# EAGLE design circuitplay rev G (EAGLE 6.6.0)
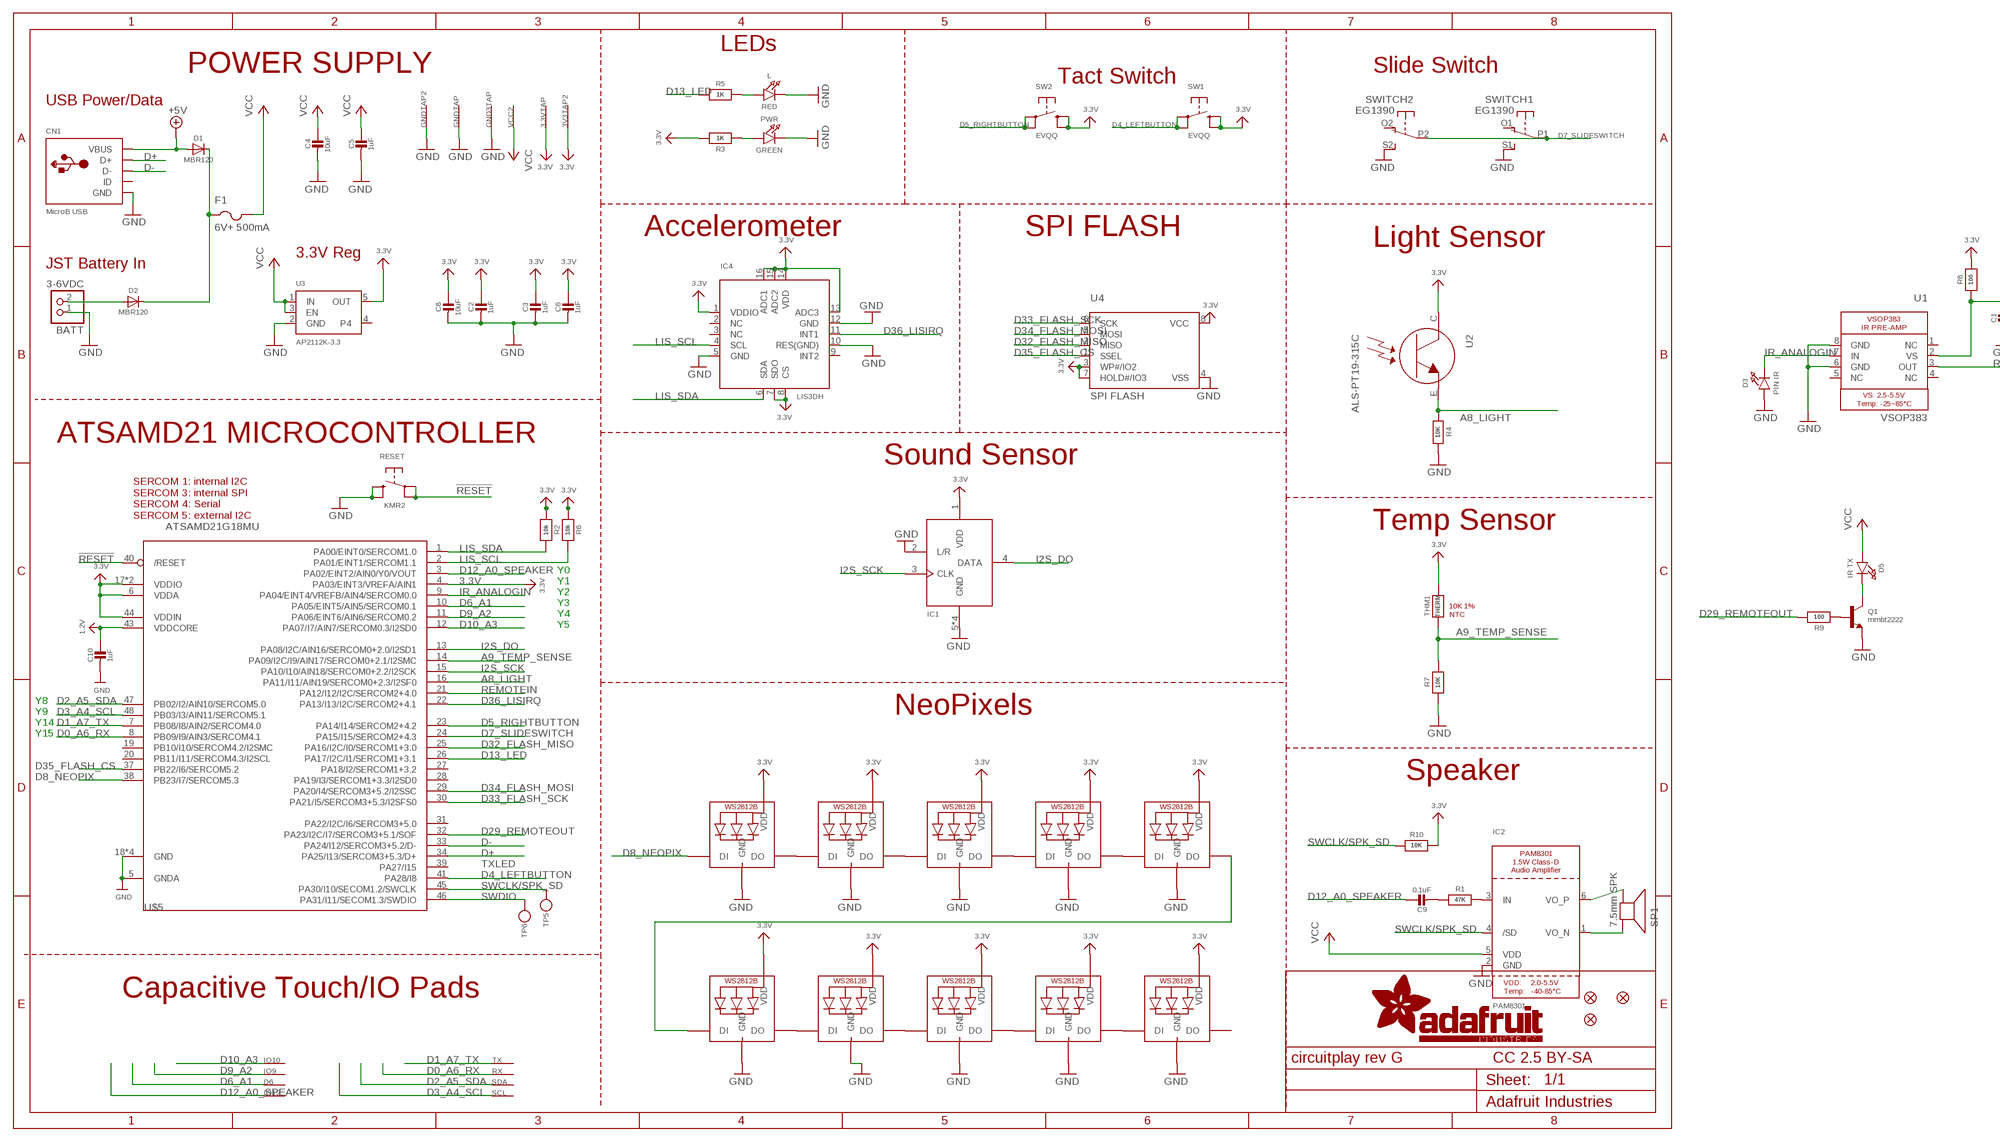
[diagram p0: schematic, sheet 1, part 1 of 2]
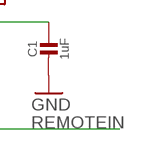
[diagram p1: schematic, sheet 1, part 2 of 2]

## Parts
3.3VTAP  SEWTAP-ALLIGATOR  [SEWALLI]
3V3TAP2  SEWTAP-ALLIGATOR  [SEWALLI]
BATT  3-6VDC  CON_JST_PH_2PIN  [JSTPH2]
C1  1uF  CAP_CERAMIC0603_NO  [0603-NO]
C2  1uF  CAP_CERAMIC0603_NO  [0603-NO]
C3  1uF  CAP_CERAMIC0603_NO  [0603-NO]
C4  10uF  CAP_CERAMIC0805-NOOUTLINE  [0805-NO]
C5  1uF  CAP_CERAMIC0603_NO  [0603-NO]
C6  1uF  CAP_CERAMIC0603_NO  [0603-NO]
C8  10uF  CAP_CERAMIC0805-NOOUTLINE  [0805-NO]
C9  0.1uF  CAP_CERAMIC0603_NO  [0603-NO]
C10  1uF  CAP_CERAMIC0603_NO  [0603-NO]
CN1  MicroB USB  USB_MICRO_20329_V2  [4UCONN_20329_V2]
D1  MBR120  DIODESOD-123  [SOD-123]
D2  MBR120  DIODESOD-123  [SOD-123]
D3  PIN IR  LED1206_NOOUTLINE  [CHIPLED_1206_NOOUTLINE]
D5  IR TX  LED1206_NOOUTLINE  [CHIPLED_1206_NOOUTLINE]
D6  SEWTAP-ALLIGATOR  [SEWALLI]
F1  6V+ 500mA  PTCFUSE-1206  [R1206]
GND3TAP  SEWTAP-ALLIGATOR  [SEWALLI]
GNDTAP  SEWTAP-ALLIGATOR  [SEWALLI]
GNDTAP2  SEWTAP-ALLIGATOR  [SEWALLI]
IC1  MIC_PDM  MIC_PDM_SPK0415  [SPK0415HM4H]
IC2  PAM8301  [SOT23-6]
IC4  LIS3DH  ACCEL_LIS3DHTR  [LGA16_3X3MM]
IO9  SEWTAP-ALLIGATOR  [SEWALLI]
IO10  SEWTAP-ALLIGATOR  [SEWALLI]
IO12  SEWTAP-ALLIGATOR  [SEWALLI]
L  RED  LED0805_NOOUTLINE  [CHIPLED_0805_NOOUTLINE]
LED1  WS2812B3535  [LED3535]
LED2  WS2812B3535  [LED3535]
LED3  WS2812B3535  [LED3535]
LED4  WS2812B3535  [LED3535]
LED5  WS2812B3535  [LED3535]
LED6  WS2812B3535  [LED3535]
LED7  WS2812B3535  [LED3535]
LED8  WS2812B3535  [LED3535]
LED9  WS2812B3535  [LED3535]
LED10  WS2812B3535  [LED3535]
PWR  GREEN  LED0805_NOOUTLINE  [CHIPLED_0805_NOOUTLINE]
Q1  mmbt2222  TRANSISTOR_NPN  [SOT23-R]
R1  47K  RESISTOR_0603_NOOUT  [0603-NO]
R2  10k  RESISTOR_0603_NOOUT  [0603-NO]
R3  1K  RESISTOR_0603_NOOUT  [0603-NO]
R4  10K  RESISTOR_0603_NOOUT  [0603-NO]
R5  1K  RESISTOR_0603_NOOUT  [0603-NO]
R6  10k  RESISTOR_0603_NOOUT  [0603-NO]
R7  10K  RESISTOR_0603_NOOUT  [0603-NO]
R8  100  RESISTOR_0603_NOOUT  [0603-NO]
R9  100  RESISTOR_0603_NOOUT  [0603-NO]
R10  10K  RESISTOR_0603_NOOUT  [0603-NO]
RESET  KMR2  SWITCH_TACT_SMT4.6X2.8  [BTN_KMR2_4.6X2.8]
RX  SEWTAP-ALLIGATOR  [SEWALLI]
SCL  SEWTAP-ALLIGATOR  [SEWALLI]
SDA  SEWTAP-ALLIGATOR  [SEWALLI]
SP1  7.5mm SPK  SPEAKER_7.5MM  [BUZZER_SMT_7.5MM]
SW1  EVQQ  SWITCH_TACT_SMT_EVQQ2_SMALL  [EVQ-Q2_SMALLER]
SW2  EVQQ  SWITCH_TACT_SMT_EVQQ2_SMALL  [EVQ-Q2_SMALLER]
SWITCH  EG1390  DPDT-EG1390  [EG1390]
THM1  THERM  RESISTOR_0402  [_0402]
TP5  TESTPOINTROUND1.5MM  [TESTPOINT_ROUND_1.5MM]
TP6  TESTPOINTROUND1.5MM  [TESTPOINT_ROUND_1.5MM]
TX  SEWTAP-ALLIGATOR  [SEWALLI]
U1  VSOP383  [VSOP383]
U2  ALS-PT19-315C  LIGHT_ALS-PT19-315C  [ALS-PT19-315C]
U3  AP2112K-3.3  VREG_SOT23-5  [SOT23-5]
U4  SPI FLASH  SPIFLASH_SOIC8  [SOIC8_150MIL]
U$2  FIDUCIAL_1MM  [FIDUCIAL_1MM]
U$3  FIDUCIAL_1MM  [FIDUCIAL_1MM]
U$5  ATSAMD21G18MU  ATSAMD21G_QFN  [TQFN48_7MM]
U$6  FIDUCIAL_1MM  [FIDUCIAL_1MM]
VCC2  SEWTAP-ALLIGATOR  [SEWALLI]

## Nets
1.2V: C10.1 U$5.43(VDDCORE)
3.3V: 3.3VTAP.P$1(SEW) 3V3TAP2.P$1(SEW) C2.1 C3.1 C6.1 C8.1 IC1.1(VDD) IC4.1(VDDIO) IC4.7(SDO) IC4.8(CS) IC4.13(ADC3) IC4.14(VDD) IC4.15(ADC2) IC4.16(ADC1) LED1.2(VDD) LED2.2(VDD) LED3.2(VDD) LED4.2(VDD) LED5.2(VDD) LED6.2(VDD) LED7.2(VDD) LED8.2(VDD) LED9.2(VDD) LED10.2(VDD) R2.1 R3.2 R6.1 R8.2 R10.2 SW1.B'(S1) SW1.B(S) SW2.B'(S1) SW2.B(S) THM1.2 U2.C U3.5(OUT) U4.3(WP#/IO2) U4.7(HOLD#/IO3) U4.8(VCC) U$5.4(PA03/EINT3/VREFA/AIN1) U$5.6(VDDA) U$5.17(VDDIO) U$5.36(VDDIO) U$5.44(VDDIN)
!RESET: RESET.A'(P1) RESET.A(P) U$5.40(/RESET)
+5V: CN1.VBUS D1.A
A8_LIGHT: R4.2 U2.E U$5.16(PA11/I11/AIN19/SERCOM0+2.3/I2SF0)
A9_TEMP_SENSE: R7.2 THM1.1 U$5.14(PA09/I2C/I9/AIN17/SERCOM0+2.1/I2SMC)
D0_A6_RX: RX.P$1(SEW) U$5.8(PB09/I9/AIN3/SERCOM4.1)
D1_A7_TX: TX.P$1(SEW) U$5.7(PB08/I8/AIN2/SERCOM4.0)
D2_A5_SDA: SDA.P$1(SEW) U$5.47(PB02/I2/AIN10/SERCOM5.0)
D3_A4_SCL: SCL.P$1(SEW) U$5.48(PB03/I3/AIN11/SERCOM5.1)
D4_LEFTBUTTON: SW1.A'(P1) SW1.A(P) U$5.41(PA28/I8)
D5_RIGHTBUTTON: SW2.A'(P1) SW2.A(P) U$5.23(PA14/I14/SERCOM2+4.2)
D6_A1: D6.P$1(SEW) U$5.10(PA05/EINT5/AIN5/SERCOM0.1)
D7_SLIDESWITCH: SWITCH.P1(1:P) SWITCH.P2(2:P) U$5.24(PA15/I15/SERCOM2+4.3)
D8_NEOPIX: LED6.1(DI) U$5.38(PB23/I7/SERCOM5.3)
D9_A2: IO9.P$1(SEW) U$5.11(PA06/EINT6/AIN6/SERCOM0.2)
D10_A3: IO10.P$1(SEW) U$5.12(PA07/I7/AIN7/SERCOM0.3/I2SD0)
D12_A0_SPEAKER: C9.1 IO12.P$1(SEW) U$5.3(PA02/EINT2/AIN0/Y0/VOUT)
D13_LED: R5.1 U$5.26(PA17/I2C/I1/SERCOM1+3.1)
D29_REMOTEOUT: R9.2 U$5.32(PA23/I2C/I7/SERCOM3+5.1/SOF)
D32_FLASH_MISO: U4.2(MISO) U$5.25(PA16/I2C/I0/SERCOM1+3.0)
D33_FLASH_SCK: U4.6(SCK) U$5.30(PA21/I5/SERCOM3+5.3/I2SFS0)
D34_FLASH_MOSI: U4.5(MOSI) U$5.29(PA20/I4/SERCOM3+5.2/I2SSC)
D35_FLASH_CS: U4.1(SSEL) U$5.37(PB22/I6/SERCOM5.2)
D36_LISIRQ: IC4.11(INT1) U$5.22(PA13/I13/I2C/SERCOM2+4.1)
D+: CN1.D+ U$5.34(PA25/I13/SERCOM3+5.3/D+)
D-: CN1.D- U$5.33(PA24/I12/SERCOM3+5.2/D-)
GND: BATT.1 C1.2 C2.2 C3.2 C4.2 C5.2 C6.2 C8.2 C10.2 CN1.BASE@1(GND) CN1.BASE@2(GND) CN1.GND CN1.SPRT@1(GND) CN1.SPRT@2(GND) CN1.SPRT@3(GND) CN1.SPRT@4(GND) D3.A GND3TAP.P$1(SEW) GNDTAP2.P$1(SEW) GNDTAP.P$1(SEW) IC1.2(L/R) IC1.5(GND) IC1.6(GND) IC1.7(GND) IC1.8(GND) IC2.2(GND) IC4.5(GND) IC4.10(RES(GND)) IC4.12(GND) L.C LED1.4(GND) LED2.4(GND) LED3.4(GND) LED4.4(GND) LED5.4(GND) LED6.4(GND) LED7.4(GND) LED8.4(GND) LED9.4(GND) LED10.4(GND) PWR.C Q1.2(E) R4.1 R7.1 RESET.B'(S1) RESET.B(S) SWITCH.S1(1:S) SWITCH.S2(2:S) U1.6(GND) U1.8(GND) U3.2(GND) U4.4(VSS) U$5.5(GNDA) U$5.18(GND) U$5.35(GND) U$5.42(GND) U$5.THERMAL(GND)
I2S_DO: IC1.4(DATA) U$5.13(PA08/I2C/AIN16/SERCOM0+2.0/I2SD1)
I2S_SCK: IC1.3(CLK) U$5.15(PA10/I10/AIN18/SERCOM0+2.2/I2SCK)
IR_ANALOGIN: D3.C U1.7(IN) U$5.9(PA04/EINT4/VREFB/AIN4/SERCOM0.0)
LIS_SCL: IC4.4(SCL) R6.2 U$5.2(PA01/EINT1/SERCOM1.1)
LIS_SDA: IC4.6(SDA) R2.2 U$5.1(PA00/EINT0/SERCOM1.0)
N$1: PWR.A R3.1
N$2: C1.1 R8.1 U1.2(VS)
N$3: D1.C D2.C F1.1
N$5: Q1.1(B) R9.1
N$6: C9.2 R1.1
N$7: BATT.2 D2.A
N$8: IC2.3(IN) R1.2
N$9: IC2.6(VO_P) SP1.-
N$10: L.A R5.2
N$11: LED1.1(DI) LED2.3(DO)
N$12: LED1.3(DO) LED3.1(DI)
N$13: LED2.1(DI) LED10.3(DO)
N$14: LED6.3(DO) LED7.1(DI)
N$15: IC2.1(VO_N) SP1.+
N$16: LED7.3(DO) LED8.1(DI)
N$17: LED8.3(DO) LED9.1(DI)
N$18: LED9.3(DO) LED10.1(DI)
N$19: LED3.3(DO) LED4.1(DI)
N$20: LED4.3(DO) LED5.1(DI)
N$21: D5.C Q1.3(C)
REMOTEIN: U1.3(OUT) U$5.21(PA12/I12/I2C/SERCOM2+4.0)
SWCLK/SPK_SD: IC2.4(/SD) R10.1 TP5.P$1 U$5.45(PA30/I10/SECOM1.2/SWCLK)
SWDIO: TP6.P$1 U$5.46(PA31/I11/SECOM1.3/SWDIO)
VCC: C4.1 C5.1 D5.A F1.2 IC2.5(VDD) U3.1(IN) U3.3(EN) VCC2.P$1(SEW)
Unconnected: CN1.ID IC4.2(NC) IC4.3(NC) IC4.9(INT2) LED5.3(DO) SWITCH.O1(1:O) SWITCH.O2(2:O) U1.1(NC) U1.4(NC) U1.5(NC) U3.4 U$5.19(PB10/I10/SERCOM4.2/I2SMC) U$5.20(PB11/I11/SERCOM4.3/I2SCL) U$5.27(PA18/I2/SERCOM1+3.2) U$5.28(PA19/I3/SERCOM1+3.3/I2SD0) U$5.31(PA22/I2C/I6/SERCOM3+5.0) U$5.39(PA27/I15)

## Notes on the sheet
- LEDs
- POWER SUPPLY | Slide Switch
- Tact Switch
- USB Power/Data
- Accelerometer | SPI FLASH
- Light Sensor
- 3.3V Reg
- JST Battery In
- ATSAMD21 MICROCONTROLLER
- Sound Sensor
- SERCOM 1: internal I2C
  SERCOM 3: internal SPI
  SERCOM 4: Serial
  SERCOM 5: external I2C
- Temp Sensor
- Y0
- Y1
- Y2
- Y3
- Y4
- 10K 1%
  NTC
- Y5
- Y8
- Y9 | NeoPixels
- Y14
- Y15
- Speaker
- TXLED
- Capacitive Touch/IO Pads
- CC 2.5 BY-SA

## Library data of the parts
3.3VTAP 3V3TAP2 D6 GND3TAP GNDTAP GNDTAP2 IO9 IO10 IO12 RX SCL SDA TX VCC2 = microbuilder:SEWTAP
BATT = microbuilder:CON_JST_PH_2PIN: JST 2-Pin Right-Angle Connector PH-Series - 4UConnector: 17311 SH-Series - 4UConnector: 07278
C1-C6 C8-C10 = microbuilder:CAP_CERAMIC: Ceramic Capacitors For new designs, use the packages preceded by an '_' character since they are more reliable: The following footprints should be used on most boards: _0402 - Standard footprint for regular board layouts _0603 - Standard footprint for regular board layouts _0805 - Standard footprint for regular board layouts _1206 - Standard footprint for regular board layouts For extremely tight-pitch boards where space is at a premium, the following 'micro-pitch' footprints can be used (smaller pads, no silkscreen outline, etc.): _0402MP - Micro-pitch footprint for very dense/compact boards _0603MP - Micro-pitch footprint for very dense/compact boards _0805MP - Micro-pitch footprint for very dense/compact boards _1206MP - Micro-pitch footprint for very dense/compact boards
CN1 = microbuilder:USB: USB Connectors USBMINIB - Surface Mount Female Mini-B USB Connector 4UConnector: 06564
D1 D2 = microbuilder:DIODE: Diode SMA Model Volts Amps Type Vf Ir Digikey # Notes SSA34-E3 40V 3A Schottky 480mV @ 3A 200uA @ 40V SSA34-E3/61TGITR-ND CDBA120-G 20V 1A Schottky 500mV @ 1A 500uA @ 20V 641-1014-6-ND REEL MBRA210 10V 2A Schottky 350mV @ 2A 700uA @ 10V MBRA210LT3 SOD-123 Model Volts Amps Type Vf Ir Order # Notes BAT54T1G 30V 200mA Schottky 800mV @ 200mA 2uA @ 25V BAT54T1GOSTR-ND B0530W 30V 500mA Schottky 430mV @ 500mA 130uA @ 30V B0530W-FDICT-ND REEL MBR120 20V 1A Schottky 340mV @ 1A MBR120VLSFT1GOSCT-ND SOD-323 Model Volts Amps Type Vf Ir Order # Notes PMEG2005EJ 20V 500mA Schottky 355mV @ 500mA 568-4110-1-ND ZLLS410 10V 570mA Schottky 380mV @ 570mA ZLLS410CT-ND 1N4148WS 75V 150mA Silicon/Simple 1V 1N4148WSFSCT-ND REEL SOD-523 Model Volts Amps Type Vf Ir Order # Notes BAT54XV2 30V 200mA Schottky 0.8V @ 100mA BAT54XV2CT-ND TB751S 30V 30mA Schottky RB751S-40TE61CT-ND SOT23-R/W (R = Solder Paste/Reflow Ovens, W = Hand-Soldering) Model Volts Amps Type Vf Ir Order # Notes BAT54FILM 40V 300mA Schottky 497-7162-1-ND POWERDI-5 Model Volts Amps Type Vf Ir Order # Notes PDS560 60V 5A Schottky 670mV @ 5A 150uA @ 60V PDS560DICT-ND
D3 D5 L PWR = microbuilder:LED: LED 0603 - 0603 Surface Mount Package 2mA: Green LED - Low Power (3.9mcd, 2ma, 1.7Vf) - Digikey: 475-2709-2-ND Orange LED - Low Power (9.8mcd, 2ma, 1.8Vf) - Digikey: 475-1194-2-ND Red LED - Low Power (5mcd, 2ma, 1.8Vf) - Digikey: 475-1195-2-ND Yellow LED - Low Power (7mcd, 2ma, 1.8Vf) - Digikey: 475-1196-2-ND 5mA: Blue LED - Low Power (17mcd, 5ma, 2.9Vf) - Digikey: LNJ937W8CRACT-ND 0805 - 0805 Surface Mount Package 2mA: Red LED (8.8mcd, 2mA, 1.8Vf, Clear) - Low Power [Digikey: 475-2510-1-ND] Green LED (5mcd, 2mA, 1.8Vf, Clear) - Low Power [Digikey: 475-2730-1-ND] Yellow LED (11.3mcd, 2mA, 1.8Vf, Clear) - Low Power [Digikey: 475-2555-1-ND] 20mA: Red LED (104mcd, 20mA, Diffused) - LS R976 [Digikey: 475-1278-6-ND] Red LED (12mcd, 20mA, 2.0Vf, Clear) - APT2012EC [Digikey: 754-1128-1-ND] Green LED (15mcd, 20mA, 2.2Vf, Clear) - APT2012GC [Digikey: 754-1131-1-ND] Orange LED (160mcd, 20mA, 2.1Vf, Clear) - APT2012SECK [Digikey: 754-1130-1-ND] 1206 - 1206 Surface Mount Package Green LED (26mcd, 20mA, Diffused) - LG N971 [Digikey: 475-1407-6-ND] Red LED (15mcd, 20mA, Diffused) - LH N974 [Digikey: 475-1416-6-ND] Cree - Cree High-Power Surface Mount LEDs XPEBWT-L1-0000-00D50 - White 111lm 350mA 2.9Vf 6200K 110° XTEAWT-00-0000-00000LEE3 - White 114lm 350mA 2.85Vf 5000K 115° Everlight - Everlight 45-21 Series Surface Mount LEDs 45-21/QK2C-B2832AC2CB2/2T - Warm White 2000mcd 20mA 3.25Vf 3050K 120° 45-21/LK2C-B38452C4CB2/2T - Nuetral White 2000mcd 20mA 3.25Vf 4150K 120° 45-21/LK2C-B50634C6CB2/2T - Cold White 2200mcd 20mA 3.25Vf 5650K 120° PLCC2 Reverse Mount LS T77K-J1L2-1-0-2-R18-Z - Red 11.25mcd 2mA 1.8Vf 630nm 120° LO T77K-L1M2-24-Z - Orange 19.6mcd 2mA 1.8Vf 606nm 120° LY T77K-K2M1-26-Z - Yellow 15.7mcd 2mA 1.8Vf 587nm 120°
F1 = adafruit:PTCFUSE: PTC fuses, resettable thermistors
IC1 = microbuilder:MIC_PDM
IC2 = microbuilder:PAM8301
IC4 = microbuilder:ACCEL_LIS3DHTR: LIS3DHTR 3-Axis Accelerometer with I2C/SPI Interface VDD: 1.71-3.6V VDDIO: 1.71-VDD+0.1V Scale: +/-2g, 4g, 8g, 16g with 16--bit data output Temp:: -40°C - 85°C Mouser: 511-LIS3DHTR Digikey: 497-10613-1-ND
LED1-LED10 = microbuilder:WS2812B
Q1 = microbuilder:TRANSISTOR_NPN: NPN Transistor Transistor (NPN) 500mA 45V - BC817 [Digikey: 568-1631-1-ND] Transistor (NPN) 500mA 45V - BC817,215 [Mouser: 771-BC817-T/R] SOT23-R - SOT23 footprint optimised for use with solder paste and reflow ovens. SOT23-W - SOT23 footprint optimised for hand-soldering (larger pads).
R1-R10 THM1 = microbuilder:RESISTOR: Resistors For new designs, use the packages preceded by an '_' character since they are more reliable: The following footprints should be used on most boards: _0402 - Standard footprint for regular board layouts _0603 - Standard footprint for regular board layouts _0805 - Standard footprint for regular board layouts _1206 - Standard footprint for regular board layouts For extremely tight-pitch boards where space is at a premium, the following 'micro-pitch' footprints can be used (smaller pads, no silkscreen outline, etc.): _0402MP - Micro-pitch footprint for very dense/compact boards _0603MP - Micro-pitch footprint for very dense/compact boards _0805MP - Micro-pitch footprint for very dense/compact boards _1206MP - Micro-pitch footprint for very dense/compact boards
RESET SW1 SW2 = microbuilder:SWITCH_TACT_SMT: SMT Tact Switches 6x6mm - Digikey: P12940SCT-ND KMR2 (4.6x2.8mm) - Digikey: 401-1426-1-ND EVQ-PQHB55 - Light Touch, 160GF (4.5x4.5mm) - Digikey: P8090SCT-ND KMT0 - KMT021 NGJ LHS (etc.) IP68/Waterproof - Digikey: CKN10289CT-ND
SP1 = microbuilder:SPEAKER: SPEAKER Source: Buerklin Added PS12 (for part # PS1240 piezo) http://www.ladyada.net/library/pcb/eaglelibrary.html
SWITCH = adafruit:DPDT
TP5 TP6 = microbuilder:TESTPOINT: Test Point Various test points for characterisation and PCB testing TESTPOINT_SMT - Compact Surface Mount Test Point [Digikey: 5016KTR-ND]
U1 = microbuilder:VSOP383: VSOP383 - Preamplifier Circuit for IR Remote Control
U2 = microbuilder:LIGHT_ALS-PT19-315C: ALS-PT19-315C - Analog Light Sensor VCC: 2.5-5.5V
U3 = microbuilder:VREG_SOT23-5: SOT23-5 Fixed Voltage Regulators Part Current Out V Out V In V Dropout θJA (°C/W) TJ (°C) Digikey Part No. ADP121 150mA 3.3V 3.4-5.5V 0.09V @ 150mA -- -- ADP121-AUJZ33R7CT-ND ADP121 150mA 3.0V 3.1-5.5V 0.09V @ 150mA -- -- ADP121-AUJZ30R7CT-ND ADP122 300mA 3.3V 3.4-5.5V 0.085V @ 300mA -- -- ADP122AUJZ-3.3-R7CT-ND ADP1712 300mA 3.3V 3.5-5.5V 0.17V @ 300mA -- -- ADP1712AUJZ-3.3-R7TR-ND AP7311 (Low Cost) 150mA 3.3V 3.5-6V 0.15V @ 150mA -- -- AP7311-33WG-7DICT-ND LD39015M18R 150mA 1.8V 1.9V-5.5V 0.08V @ 100mA -- -- 497-6977-1-ND LP2985A-33DBVR 150mA 3.3V 3.3-16V 0.28V @ 150mA 206 150 296-18479-1-ND MCP1824T-3302E/OT 300mA 3.3V 3.5V-6V 0.2V @ 300mA -- -- MCP1824T-3302E/OTCT-ND MIC5205-2.5YM5 TR 150mA 2.5V 2.7-16V 0.165V @ 150mA -- -- 576-1257-2-ND MIC5205-3.0YM5 TR 150mA 3.0V 3.2V-16V 0.165V @ 150mA -- -- 576-1258-2-ND MIC5205-3.3YM5 TR 150mA 3.3V 3.5V-16V 0.165V @ 150mA -- -- 576-1259-2-ND TPS780330220 150mA 3.3V+2.2V 3.6-5.5V 250mV Max -- -- 296-23332-1-ND TDA3663/N1,135 100mA 3.3V 3.5-45V 0.18V @ 50mA -- -- 568-5343-1-ND Max operating temp can be calculated using θJA, TJ (max junction temperature), and power in watts. Set the "Maximum Ambient Temperature" until it reaches TJ ("Max Junction Temperature"), which is the absolute limit for safe use of the regulator: Heat Sink Temperature Calculator <http://www.daycounter.com/Calculators/Heat-Sink-Temperature-Calculator.phtml> For example, With 12V source into a 3.3V LP2985 and a 30mA load, we are dissipating (12V-3.3V) * 0.03A = 0.261W. With a θJA of 206 °C/W, a TJ of 150°C, and 261mW we can safely use the chip without a heat sink up to 75°C (=147.1°C Junction Temperature).
U4 = microbuilder:SPIFLASH_SOIC8: SOIC8 SPI Flash Be careful with the size since SOIC8 flash comes in several 'widths' SOIC8 150 mil M25P16 - 16Mbit (2Mbit x 8) Serial Flash (75MHz SPI Bus), Supply: 2.7-3.6V Digikey: SOIC8 - M25P16-VMN6P-ND SOIC8 208 mil W25Q16BVSSIG - 16Mbit (2Mbit x 8) Serial Flash (104MHz SPI Bus), Supply: 2.7-3.6V Digikey: SOIC8 - W25Q16BVSSIG-ND
U$2 U$3 U$6 = microbuilder:FIDUCIAL: Fiducial Alignment Points Various fiducial points for machine vision alignment.; BOM: EXCLUDE
U$5 = microbuilder:ATSAMD21G

## Board
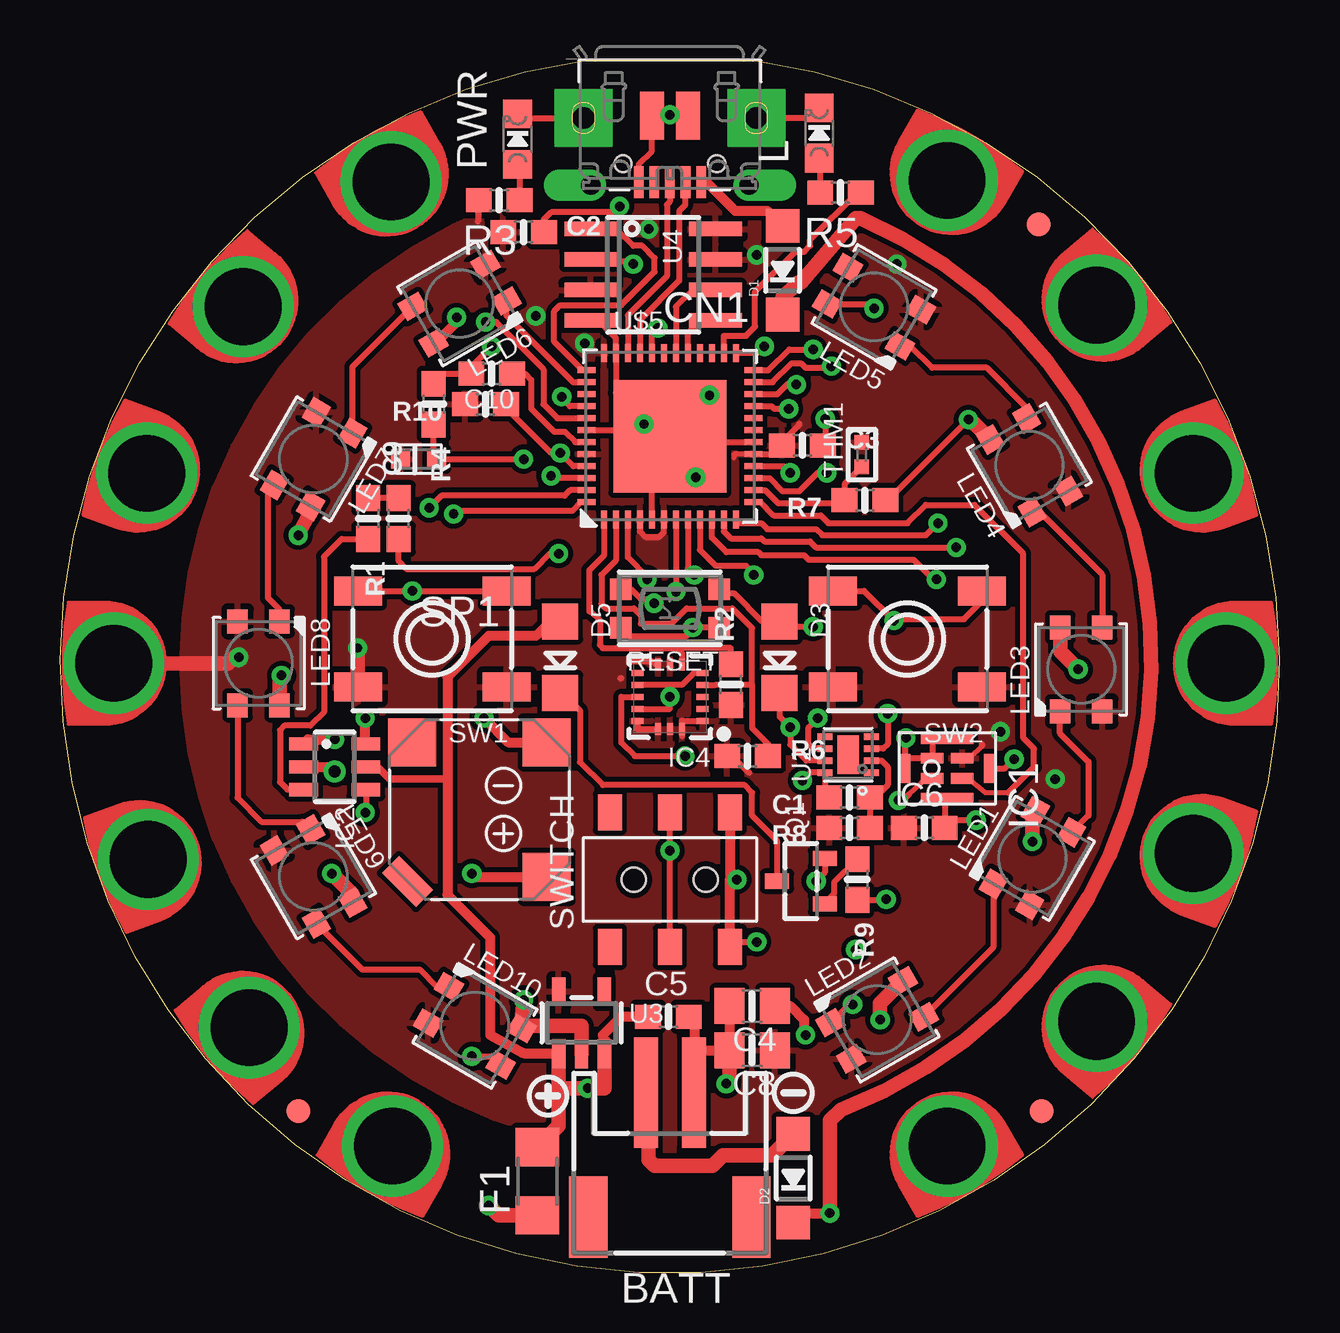
[diagram p2: board, top side]
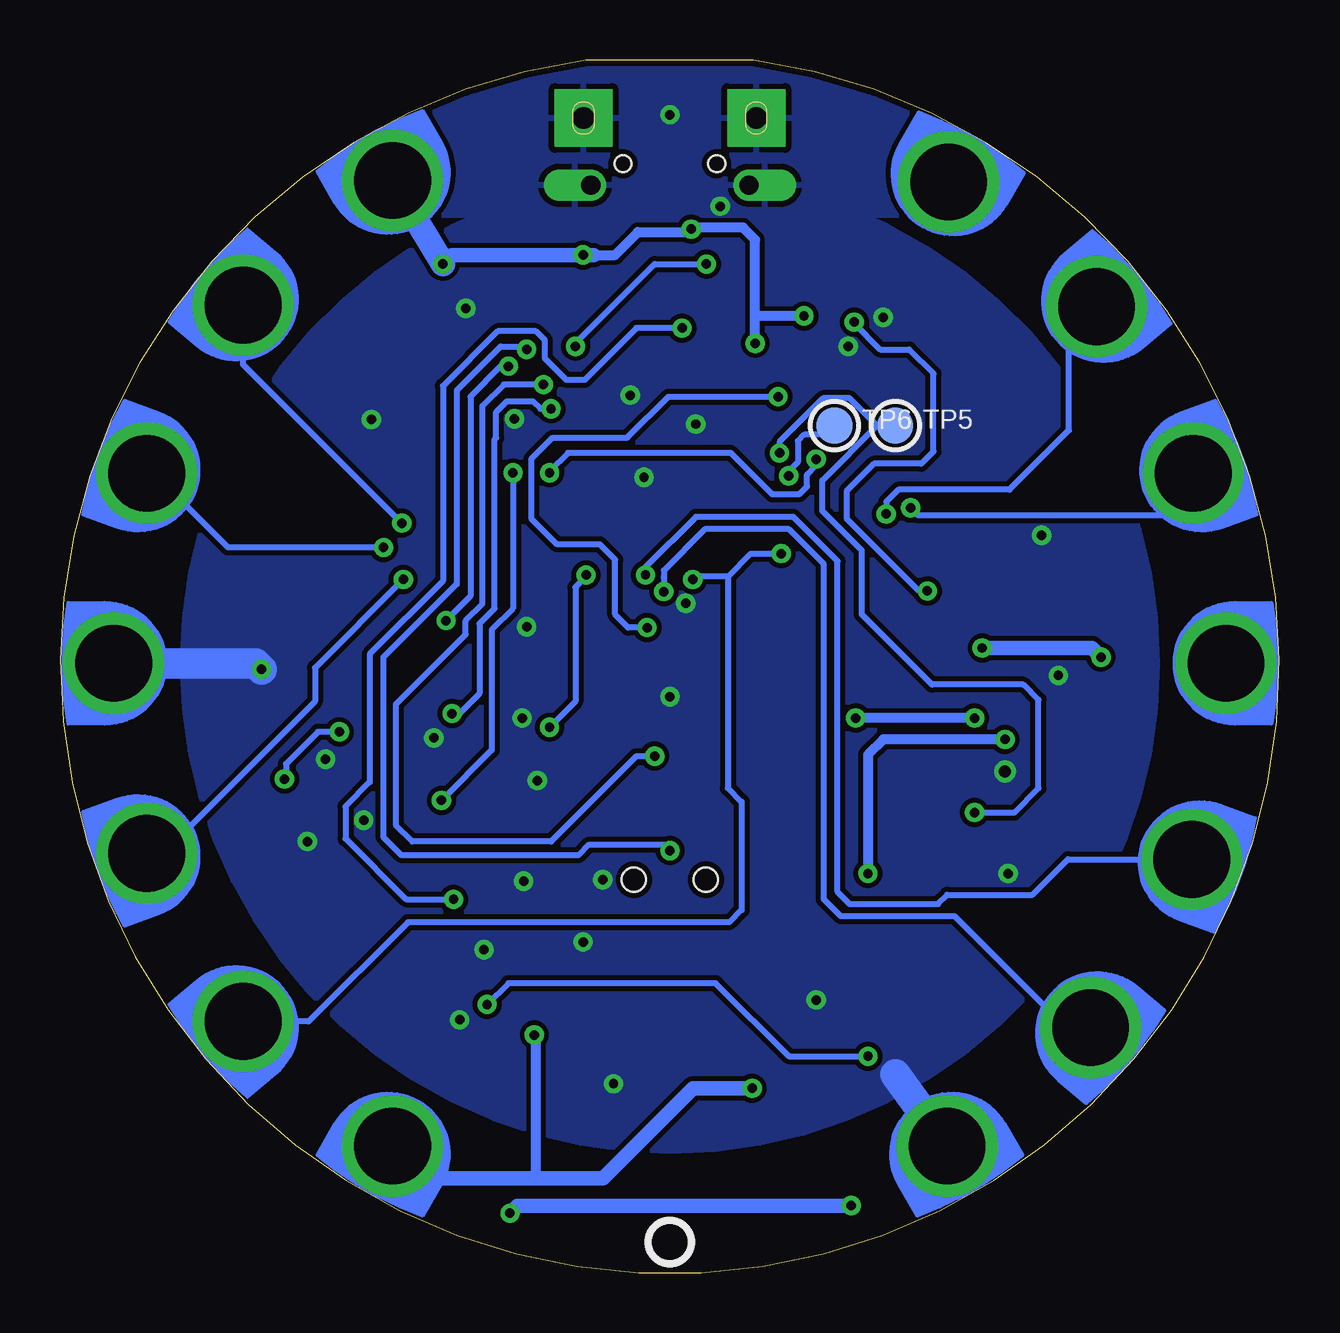
[diagram p3: board, bottom side, seen from below]

Size 50.82 x 50.55 mm. Coordinates in mm from the lower left corner, seen from the top.
Outline: 21.92,50.55 28.9,50.55 arc-344 21.92,50.55
Copper layers (1*16): Top 0.035mm / dielectric 1.5mm / Bottom 0.035mm
Design rules "adafruit *": minimum track width 8mil, minimum drill 15.5mil, track to track 8mil, track to pad 7mil, pad to pad 8mil, via to via 8mil, smd to smd 8mil, copper to edge 10mil, drill to drill 8mil, minimum pad ring 10mil, minimum via ring 8mil, stop-mask expansion 2mil, vias tented up to drill 20mil, thermal gap 10mil

### Footprints (pad centres in the part's own frame; a part is rotated, then mirrored left to right if it is on the bottom)
SEWALLI = drill 3.2: P$1 0,0.508
JSTPH2 = smd 1 x 4.6: 1 -1,-3.7; 2 1,-3.7 | smd 1.6 x 3.4: NC1 -3.4,1.5; NC2 3.4,1.5
0603-NO = smd 1.075 x 1: 1 -0.85,0; 2 0.85,0
0805-NO = smd 1.24 x 1.5: 1 -0.95,0; 2 0.95,0
4UCONN_20329_V2 = smd 1 x 2: BASE@1 -0.75,-2; BASE@2 0.75,-2 | smd 0.4 x 1.35: D+ 0,0.775; D- -0.65,0.775; GND 1.3,0.775; ID 0.65,0.775; VBUS -1.3,0.775 | drill 0.8 pad 1.143 offset: SPRT@1 -3.3,0.9; SPRT@2 3.3,0.9 | drill 0.9 pad 2.413 square: SPRT@3 -3.6,-1.9; SPRT@4 3.6,-1.9 | hole 0.7: -1.95,0; 1.95,0
SOD-123 = smd 1.4 x 1.4: A 1.85,0; C -1.85,0
CHIPLED_1206_NOOUTLINE = smd 1.5 x 1.5: A 0,-1.496; C 0,1.496
R1206 = smd 1.6 x 1.803: 1 -1.422,0; 2 1.422,0
SPK0415HM4H = smd 0.45 x 0.95: 1 0.425,-0.625; 2 0.425,0.625; 3 -0.425,0.625; 4 -0.425,-0.625 | smd 1.2 x 0.45: 5 0,-1.75; 7 0,1.75 | smd 0.45 x 2.2: 6 1.25,0; 8 -1.25,0
SOT23-6 = smd 0.55 x 1.2: 1 -0.95,-1.3; 2 0,-1.3; 3 0.95,-1.3; 4 0.95,1.3; 5 0,1.3; 6 -0.95,1.3
LGA16_3X3MM = smd 0.5 x 0.25: 1 -1.35,1; 2 -1.35,0.5; 3 -1.35,0; 4 -1.35,-0.5; 5 -1.35,-1; 9 1.35,-1; 10 1.35,-0.5; 11 1.35,0; 12 1.35,0.5; 13 1.35,1 | smd 0.25 x 0.5: 6 -0.5,-1.35; 7 0,-1.35; 8 0.5,-1.35; 14 0.5,1.35; 15 0,1.35; 16 -0.5,1.35
CHIPLED_0805_NOOUTLINE = smd 1.2 x 1.2: A 0,-1.05; C 0,1.05
LED3535 = smd 1 x 0.85: 1 -1.75,0.875; 2 -1.75,-0.875; 3 1.75,-0.875; 4 1.75,0.875
SOT23-R = smd 0.635 x 1.016: 1 -0.95,-1; 2 0.95,-1; 3 0,1
BTN_KMR2_4.6X2.8 = smd 0.9 x 0.9: A 2.05,0.8; A' -2.05,0.8; B 2.05,-0.8; B' -2.05,-0.8
BUZZER_SMT_7.5MM = smd 2 x 2: + 2.8,-2.8; - 2.8,2.8; MT2 -2.8,2.8 | smd 2 x 1 rotated 135: MT -3,-3
EVQ-Q2_SMALLER = smd 2 x 1.2: A -3.1,-2; A' 3.1,-2; B -3.1,2; B' 3.1,2
EG1390 = smd 1 x 1.5: O1 -2.5,2.8; O2 -2.5,-2.8; P1 0,2.8; P2 0,-2.8; S1 2.5,2.8; S2 2.5,-2.8 | hole 1: 1.5,0; -1.5,0
_0402 = smd 0.6 x 0.6: 1 -0.508,0; 2 0.508,0
TESTPOINT_ROUND_1.5MM = smd 1.5 x 1.5: P$1 0,0
VSOP383 = smd 0.275 x 0.625: 1 -0.75,-0.975; 2 -0.25,-0.975; 3 0.25,-0.975; 4 0.75,-0.975; 5 0.75,0.975; 6 0.25,0.975; 7 -0.25,0.975; 8 -0.75,0.975 | smd 1.6 x 0.9: THERMAL 0,0
ALS-PT19-315C = smd 0.8 x 0.8: C -0.75,0; E 0.75,0
SOT23-5 = smd 0.55 x 1.2: 1 -0.95,-1.3; 2 0,-1.3; 3 0.95,-1.3; 4 0.95,1.3; 5 -0.95,1.3
SOIC8_150MIL = smd 0.6 x 2.2: 1 -1.905,-2.6; 2 -0.635,-2.6; 3 0.635,-2.6; 4 1.905,-2.6; 5 1.905,2.6; 6 0.635,2.6; 7 -0.635,2.6; 8 -1.905,2.6
FIDUCIAL_1MM = smd 1 x 1: 1 0,0
TQFN48_7MM = smd 0.25 x 0.75: 1 -2.75,-3.475; 2 -2.25,-3.475; 3 -1.75,-3.475; 4 -1.25,-3.475; 5 -0.75,-3.475; 6 -0.25,-3.475; 7 0.25,-3.475; 8 0.75,-3.475; 9 1.25,-3.475; 10 1.75,-3.475; 11 2.25,-3.475; 12 2.75,-3.475; 25 2.75,3.475; 26 2.25,3.475; 27 1.75,3.475; 28 1.25,3.475; 29 0.75,3.475; 30 0.25,3.475; 31 -0.25,3.475; 32 -0.75,3.475; 33 -1.25,3.475; 34 -1.75,3.475; 35 -2.25,3.475; 36 -2.75,3.475 | smd 0.75 x 0.25: 13 3.475,-2.75; 14 3.475,-2.25; 15 3.475,-1.75; 16 3.475,-1.25; 17 3.475,-0.75; 18 3.475,-0.25; 19 3.475,0.25; 20 3.475,0.75; 21 3.475,1.25; 22 3.475,1.75; 23 3.475,2.25; 24 3.475,2.75; 37 -3.475,2.75; 38 -3.475,2.25; 39 -3.475,1.75; 40 -3.475,1.25; 41 -3.475,0.75; 42 -3.475,0.25; 43 -3.475,-0.25; 44 -3.475,-0.75; 45 -3.475,-1.25; 46 -3.475,-1.75; 47 -3.475,-2.25; 48 -3.475,-2.75 | smd 4.7 x 4.7: THERMAL 0,0

### Placement (x,y rotation side)
3.3VTAP  2.74,25.4 90 top
3V3TAP2  36.71,45.09 330 top
BATT  25.41,3.81 180 top
C1  32.9,19.81 180 top
C2  19.31,43.37 0 top
C3  30.93,34.48 0 top
C4  28.84,11.11 180 top
C5  25.35,10.67 0 top
C6  36.01,18.54 0 top
C8  28.84,9.27 180 top
C9  14.11,31.43 90 top
C10  17.98,37.47 180 top
CN1  25.41,46.23 180 top
D1  30.11,41.78 90 top
D2  30.55,3.94 90 top
D3  29.98,25.65 180 top
D5  20.84,25.65 180 top
D6  46.75,17.65 250 top
F1  19.89,3.81 90 top
GND3TAP  14.04,45.02 30 top
GNDTAP  48.08,25.4 270 top
GNDTAP2  14.11,5.72 150 top
IC1  36.97,21.02 90 top
IC2  11.44,21.08 270 top
IC4  25.41,24 180 top
IO9  46.75,33.15 290 top
IO10  42.81,40.01 310 top
IO12  42.81,10.8 230 top
L  31.63,47.5 0 top
LED1  40.52,17.27 60 top
LED2  34.05,10.54 30 top
LED3  42.55,25.15 90 top
LED4  40.4,33.66 120 top
LED5  33.92,40.26 150 top
LED6  16.65,40.39 210 top
LED7  10.55,33.91 240 top
LED8  8.26,25.4 270 top
LED9  10.55,16.51 300 top
LED10  17.28,10.29 330 top
PWR  19.06,47.24 0 top
Q1  30.87,16.32 90 top
R1  12.84,31.43 270 top
R2  27.95,24.51 90 top
R3  18.3,44.7 180 top
R4  15.57,36.2 270 top
R5  32.52,45.02 180 top
R6  28.65,21.53 0 top
R7  33.54,32.19 180 top
R8  32.9,18.54 180 top
R9  33.22,16.38 270 top
R10  17.73,36.2 180 top
RESET  25.41,27.69 180 top
RX  4.14,17.4 110 top
SCL  8.01,39.94 50 top
SDA  4.07,33.15 70 top
SP1  17.47,19.3 0 top
SW1  15.5,26.42 180 top
SW2  35.32,26.42 180 top
SWITCH  25.41,16.38 0 top
THM1  33.41,34.1 90 top
TP5  16.01,35.31 0 bottom
TP6  18.55,35.31 0 bottom
TX  8.26,10.54 130 top
U1  32.84,21.59 90 top
U2  14.93,33.91 0 top
U3  21.73,10.41 0 top
U4  24.71,41.59 270 top
U$1  [SYMBOL_MINUS]  30.55,7.49 0 top
U$2  40.78,43.69 0 top
U$3  9.92,6.73 0 top
U$4  [FLORAMED]  37.09,27.31 0 bottom
U$5  25.41,34.86 0 top
U$6  40.9,6.73 0 top
U$7  [PCBFEAT-REV-040]  25.41,1.27 0 bottom
U$16  [CPLAY_EXPRESS_FRONT_REVG]  0.01,0 0 top
U$35  [SYMBOL_PLUS]  20.33,7.37 0 top
U$46  [CPLAY_EXPRESS_BACK_REVD]  50.81,0 0 bottom
VCC2  36.71,5.72 210 top

### Tracks (layer width: path | path; a pad name or v marks a point on that pad's centre or on a via)
1.2V
  Top 0.254: U$5.43 21.47,34.61 21.03,35.05 20.58,35.05 19.63,36 19.63,37.21 19.37,37.47 C10.1
3.3V  (via drill 0.39)
  Top 0.203: U$5.17 28.08,34.11 28.08,33.97 | 37.9,21.44 38.43,21.97
  Top 0.254: R3.2 arc90 17.41,44.67 17.41,43.82 | U$5.4 24.16,30.91 24.39,30.67 24.96,30.67 25.16,30.86 U$5.6 | IC4.8 24.82,25.35 24.71,25.46 23.7,25.46 | 30.08,34.62 C3.1 30.08,34.11 U$5.17 | 30.08,34.62 30.08,34.77 | IC1.1 37.9,21.44 | 30.08,34.62 30.81,35.34 30.81,35.37 | 25.92,22.35 IC4.16 25.91,23 IC4.1 | 23.34,24.77 23.38,24.77 | IC4.13 24.06,22.65 IC4.14 | R6.1 28.01,21.53 28.71,20.83 | 38.43,21.97 38.43,22.04 | v41.48,20.57 41.48,20.45 41.54,20.38
  Top 0.61: 3.3VTAP.P$1 6.99,25.4 7.25,25.65 v7.44,25.65 | SW1.B' v12.39,26.04
  Bottom 0.254: v39.19,22.54 40.08,22.54 41.41,21.21 41.41,20.64 v41.48,20.57
  Bottom 0.406: v29.03,42.42 28.58,42.42 27.7,42.42 26.74,43.37 24.65,43.37 v24.52,43.5 24.46,43.56 22.36,43.56 21.85,43.05 21.85,39.88 | v21.85,38.74 21.85,39.88 | v19.82,39.88 21.85,39.88
  Bottom 0.61: 28.58,42.42 34.49,42.42 v34.87,42.04 | v12.39,26.04 7.82,26.04 v7.44,25.65
  Bottom 1.016: 3V3TAP2.P$1 v34.87,42.04
  pour Top: 25.41,5.08 arc-90 5.09,25.4 arc-90 25.41,45.72 arc-90 45.73,25.4 arc-90
!RESET  (via drill 0.39)
  Top 0.254: U$5.40 21.24,36.11 20.9,36.45 v20.9,36.51 | RESET.A 23.7,26.54 26.11,26.54 26.36,26.8 v26.36,26.89 RESET.A'
  Bottom 0.254: v20.9,36.51 25.47,36.51 27.19,34.8 30.3,34.8 31.19,33.91 31.19,31.43 30.11,30.35 28.33,30.35 27.7,29.72 27.7,27.43 27.15,26.89 v26.36,26.89
+5V
  Top 0.406: CN1.VBUS 26.94,45.45 28.13,44.26 29.47,44.26 D1.A
A8_LIGHT  (via drill 0.39)
  Top 0.254: U$5.16 30.15,33.61 v30.43,33.34 | 15.81,34.04 U2.E | 15.81,34.04 15.57,34.28 R4.2 | 15.81,34.04 15.94,33.91 v19.31,33.91
  Bottom 0.254: v30.43,33.34 30.43,33.4 29.66,34.16 22.87,34.16 21.15,32.45 20.01,32.45 19.69,32.77 19.69,33.27 19.31,33.66 v19.31,33.91
A9_TEMP_SENSE
  Top 0.254: U$5.14 29.37,32.61 29.92,32.07 32.56,32.07 R7.2 | 32.5,32 R7.2 | THM1.1 32.69,32.87 R7.2
D0_A6_RX  (via drill 0.39)
  Top 0.254: U$5.8 26.16,29.35 v26.43,29.08
  Bottom 0.254: 3.06,17.27 3.1,17.23 RX.P$1 8.82,17.23 10.3,15.75 13.85,15.75 14.23,15.37 17.92,15.37 18.42,15.88 18.42,29.66 20.27,31.5 24.33,31.5 26.43,29.4 v26.43,29.08 26.43,29.27
D1_A7_TX  (via drill 0.39)
  Top 0.254: U$5.7 v25.66,28.39
  Bottom 0.254: 9.14,10.21 8.9,10.21 | 8.9,10.21 TX.P$1 | v25.66,28.39 25.66,28.96 25.66,29.02 25.66,29.27 23.95,30.99 20.46,30.99 19,29.53 19,15.56 18.3,14.86 13.54,14.86 8.9,10.21
D2_A5_SDA  (via drill 0.39)
  Top 0.254: U$5.47 21.25,32.61 21.03,32.39 15.88,32.39 v15.38,31.88
  Bottom 0.254: v15.38,31.88 15.06,31.56 4.85,31.56 3.6,32.81 SDA.P$1
D3_A4_SCL  (via drill 0.39)
  Top 0.254: U$5.48 21.71,32.11 21.35,31.75 16.52,31.75 v16.39,31.62
  Bottom 0.254: 8.71,39.18 SCL.P$1 8.77,39.12 8.77,35.12 11.25,32.64 15.88,32.64 16.39,32.13 v16.39,31.62
D4_LEFTBUTTON  (via drill 0.39)
  Top 0.254: SW1.A v14.68,28.42 SW1.A' | U$5.41 20.72,35.61 20.14,36.2 20.14,37.66 18.17,39.62 v17.73,39.62
  Bottom 0.254: v17.73,39.62 17.73,39.56 16.65,38.48 15.44,38.48 14.42,37.47 14.42,34.23 14.93,33.72 16.9,33.72 18.04,32.58 18.04,31.43 15.03,28.42 v14.68,28.42
D5_RIGHTBUTTON  (via drill 0.39)
  Top 0.254: U$5.23 29.69,37.11 30.49,37.91 30.87,37.91 31.06,37.72 32.08,37.72 v32.14,37.78 | SW2.A 38.42,27.99 37.66,27.24 34.81,27.24 v34.74,27.18 33.51,28.42 SW2.A'
  Bottom 0.254: v34.74,27.18 33.73,28.19 33.73,36.51 32.46,37.78 v32.14,37.78
D6_A1  (via drill 0.39)
  Top 0.254: U$5.10 27.16,30.64 27.76,30.04 29.09,30.04 29.22,29.91 31,29.91 31.19,29.72 35.57,29.72 36.4,28.89 v36.52,28.89
  Bottom 0.254: 47.05,17.65 D6.P$1 46.54,17.48 40.21,23.81 40.21,25.21 v36.52,28.89
D7_SLIDESWITCH  (via drill 0.39)
  Top 0.254: U$5.24 29.52,37.61 30.39,38.48 v31.38,38.48 | SWITCH.P1 v25.41,17.59 SWITCH.P2
  Bottom 0.254: v25.41,17.59 25.66,17.84 28.77,17.84 29.22,17.4 36.59,17.4 37.35,18.16 37.35,25.65 34.3,28.7 34.3,36.77 32.46,38.61 31.51,38.61 v31.38,38.48
D8_NEOPIX
  Top 0.254: U$5.38 21.38,37.11 18.6,39.89 LED6.1
D9_A2  (via drill 0.39)
  Top 0.254: 45.98,33.78 46.83,32.93 IO9.P$1 46.89,33.66 | U$5.11 27.66,30.9 27.95,30.61 29.22,30.61 29.35,30.48 31.25,30.48 31.51,30.23 v37.35,30.23
  Bottom 0.254: 46.03,33.32 IO9.P$1 46.99,33.08 46.68,33.08 43.82,30.23 v37.35,30.23
D10_A3  (via drill 0.39)
  Top 0.254: U$5.12 28.3,31.24 29.22,31.24 29.47,30.99 31.51,30.99 31.76,30.73 36.08,30.73 v36.59,31.24
  Bottom 0.254: v36.59,31.24 43.2,37.85 IO10.P$1
D12_A0_SPEAKER  (via drill 0.39)
  Top 0.254: U$5.3 23.66,29.82 24.46,29.02 v24.46,28.89 | C9.1 14.11,29.66 14.42,29.34 19.76,29.34 20.39,29.97 v20.77,29.97
  Bottom 0.254: 24.46,28.96 v24.46,28.89 24.33,29.02 23,29.02 | 23,29.02 23,20.19 22.42,19.62 22.42,15.11 22.93,14.61 36.33,14.61 40.47,10.47 IO12.P$1 | 23,29.02 22.04,29.97 v20.77,29.97
D13_LED
  Top 0.254: U$5.26 27.66,39.05 28.58,39.05 28.97,39.43 28.97,40.89 30.62,42.55 31,42.55 31.25,42.8 31.25,43.05 33.22,45.02 R5.1
D29_REMOTEOUT  (via drill 0.39)
  Top 0.254: U$5.32 24.66,39.13 v24.9,39.37 | R9.2 34.4,15.53 v34.43,15.56
  Bottom 0.254: v24.9,39.37 26.81,39.37 28.97,37.21 29.73,37.21 30.62,38.1 30.62,38.86 31,39.24 32.59,39.24 34.87,36.96 34.87,28.83 37.92,25.78 37.92,20.45 38.93,19.43 38.93,18.1 36.4,15.56 v34.43,15.56
D32_FLASH_MISO  (via drill 0.39)
  Top 0.254: U$5.25 28.18,38.35 29.09,38.35 v29.35,38.61 | U4.2 22.17,42.16 23.76,42.16 v23.89,42.04
  Bottom 0.254: v23.89,42.04 26.04,42.04 29.41,38.67 v29.35,38.61
D33_FLASH_SCK
  Top 0.254: U4.6 26.36,40.96 25.66,40.26 U$5.30
D34_FLASH_MOSI
  Top 0.254: U$5.29 26.16,39.17 26.68,39.69 U4.5
D35_FLASH_CS
  Top 0.254: U$5.37 21.77,37.61 20.58,38.8 20.58,40.07 20.84,40.32 23.38,40.32 24.77,41.72 24.77,42.29 24.27,42.8 23.89,42.8 23.19,43.5 U4.1
D36_LISIRQ  (via drill 0.39)
  Top 0.254: U$5.22 29.89,36.61 30.3,37.02 v30.68,37.02 | v26.04,21.53 23.95,21.53 23.38,22.1 23.38,24 IC4.11
  Bottom 0.254: v30.68,37.02 30.68,36.96 30.74,37.02 32.33,37.02 33.22,36.13 33.22,27.88 33.92,27.18 33.92,26.61 36.84,23.69 36.84,18.67 36.14,17.97 30.36,17.97 26.81,21.53 v26.04,21.53
D+
  Top 0.254: U$5.34 23.66,39.91 25.28,41.53 25.28,44.51 25.41,44.64 CN1.D+
D-
  Top 0.254: CN1.D- 26.06,44.51 25.79,44.25 25.79,41.34 24.16,39.71 U$5.33
GND  (via drill 0.39, 0.5)
  Top 0.254: PWR.C arc90 19.23,48.13 CN1.SPRT@4 | L.C 31.21,48.13 CN1.SPRT@3 | 10.42,31.95 LED7.4 10.43,31.74 | 13.73,5.84 13.73,5.4 | CN1.GND 24.11,46.2 24.66,46.75 CN1.BASE@2 CN1.BASE@1 26.13,48.26 v25.41,48.26 | 25.66,34.61 U$5.THERMAL 25.16,35.11 24.59,35.11 | 25.66,34.61 U$5.18 | U$5.42 24.59,35.11 | 24.59,35.11 v24.33,35.37 24.33,35.75 23.76,36.32 23.5,36.32 23.16,36.67 U$5.35 23.16,38.95 22.42,39.69 U4.4 | 25.66,34.61 25.66,33.98 | 25.66,33.98 v26.49,33.15 24.66,33.15 U$5.5 24.66,33.92 25.6,33.92 25.66,33.98 | 37.66,35.5 37.79,35.5 v37.86,35.56 34.49,32.2 R7.1 | RESET.B' 27.73,28.22 27.83,28.32 28.08,28.32 29.25,27.15 D3.A 30.21,26.92 v31.38,26.92 | v23.31,44.45 23.25,44.45 23,44.2 20.46,44.2 20.16,43.9 C2.2 20.39,43.14 20.39,43.62 | IC4.12 25.41,23.5 v25.41,24 25.41,24.51 25.4,24.5 | 25.4,24.5 IC4.10 | IC4.5 26.41,25 25.91,24.5 25.4,24.5 | IC1.6 36.34,22.27 IC1.2 35.22,21.44 IC1.7 35.22,22.25 v35.25,22.29 | IC1.8 36.86,19.67 C6.2 37.18,18.86 v38.17,18.86 | 31.93,19.94 C1.2 | U1.6 31.38,21.84 31.19,22.04 31.19,22.73 v31.57,23.11 | C1.2 31.86,20 U1.8 31.26,20.84 v30.93,20.51 | 27.91,19.5 SWITCH.S1 | 31.93,19.94 C1.2 | RESET.B 23.78,28.49 24.2,28.07 24.58,28.07 v24.75,27.9 | v17.98,38.61 17.13,37.76 C10.2 15.99,37.47 R4.1 | LED5.4 33.74,40.38 v33.92,40.2 | v31.89,35.59 31.89,34.58 C3.2 | Q1.2 31.87,16.68 v31.51,16.32 | IC1.5 39.38,21.02 v39.76,21.4 | SWITCH.S2 28.11,13.78 v29.03,13.78 | BATT.1 26.43,7.49 26.68,7.49
  Top 0.406: SWITCH.S2 27.91,16.38 | SWITCH.S1 27.91,16.38 | 27.91,16.38 v28.2,16.38 | 9.14,23.56 LED8.4 9.18,23.65 | IC2.2 11.25,21.08 v11.44,20.89 | 26.66,7.51 26.68,7.49 | 15.65,38.75 16.52,39.62 v16.52,39.82 | C4.2 C8.2 26.43,9.27 | C5.2 26.43,10.44 26.43,9.27 | 26.43,9.27 26.43,8.38 26.41,8.37 BATT.1
  Top 0.61: LED2.4 34.17,11.22 v34.17,10.54 | LED3.4 41.68,25.89 v42.43,25.15 | LED4.4 37.94,35.56 v37.86,35.56 | U3.2 21.73,10.29 19.35,10.29 LED10.4 19.24,10.73 v19.31,11.37 | 10.43,31.74 v9.92,30.73 | LED9.4 12.18,15.77 v11.31,16.64 | LED6.4 15.65,38.75 | LED8.4 9.14,24.89 v9.22,24.89 | LED1.4 40.52,19.23 v40.52,17.97 | v27.76,7.87 27.89,8 C8.2
  Top 1.27: 13.73,5.4 GNDTAP2.P$1
  Bottom 0.254: 33.66,40.01 33.79,40.01 | v40.52,17.97 40.4,17.97 | v42.43,25.15 42.43,25.4 42.3,25.53
  Bottom 1.27: GNDTAP2.P$1 16.01,8.26 | GNDTAP.P$1 42.68,25.4 v42.43,25.15
  other vias: 27.06,36.58 33.16,13.46
  pour Bottom: 25.41,5.08 arc-90 5.09,25.4 arc-90 25.41,45.72 arc-90 45.73,25.4 arc-90
  pour Bottom: 14.74,50.8 14.61,44.07 35.44,44.07 35.57,50.8
I2S_DO
  Top 0.203: 39.51,20 38.55,20 37.84,20.59 IC1.4
  Top 0.254: 39.51,20 40.59,21.08 40.59,21.84 40.14,22.29 40.14,29.97 38.11,32 36.08,32 35.32,31.24 32.01,31.24 31.7,31.56 29.73,31.56 29.18,32.11 U$5.13
I2S_SCK  (via drill 0.39)
  Top 0.203: IC1.3 36.1,20.59 35.38,19.94
  Top 0.254: U$5.15 29.57,33.11 30.11,32.58 30.81,32.58 31.57,33.34 v31.95,33.34 | 35.38,19.94 35.13,19.69 v34.93,19.69
  Bottom 0.254: v31.95,33.34 31.95,27.69 32.84,26.8 32.84,21.78 v34.93,19.69
IR_ANALOGIN  (via drill 0.39)
  Top 0.254: U1.7 31.1,21.34 30.43,22.02 v30.43,22.73 29.98,23.18 D3.C | U$5.9 26.66,30.12 27.31,29.46 28.58,29.46 28.97,29.08 v28.9,29.08
  Bottom 0.254: v28.9,29.08 28.9,29.02 29.35,28.58 29.35,23.81 v30.43,22.73
LIS_SCL
  Top 0.254: U$5.2 23.16,29.69 22.55,29.08 22.55,27.88 22.74,27.69 23.91,27.69 24.2,27.39 24.2,27.05 25.47,27.05 26.11,27.69 28.01,27.69 28.84,26.86 28.84,24.51 | IC4.4 27.31,24.5 27.31,24.51 28.84,24.51 | 28.84,24.51 28.84,22.69 29.5,22.04 R6.2
LIS_SDA
  Top 0.254: 25.91,25.78 IC4.6 25.91,25.85 25.72,26.04 | U$5.1 22.66,29.89 22.04,29.27 22.04,27.56 22.11,27.56 22.49,27.18 22.49,26.16 22.62,26.04 25.72,26.04 | R2.2 27.95,26.04 25.72,26.04
N$1
  Top 0.254: PWR.A arc-90 19.15,46.11 R3.1
N$2
  Top 0.254: R8.1 C1.1 33.98,19.81 34.49,20.32 34.49,21.08 34.23,21.34 U1.2
N$3  (via drill 0.39)
  Top 0.406: D2.C 30.94,2.48 v32.08,2.48
  Top 0.61: F1.1 18.26,2.39 v17.85,2.79 | v32.08,2.48 32.08,6.34 32.53,6.8 arc136 33.35,43.94 33.16,43.94 30.87,41.28 30.74,41.28 30.11,40.64 D1.C
  Bottom 0.61: v17.85,2.79 31.76,2.79 v32.08,2.48
N$5
  Top 0.254: R9.1 32.27,16.28 32.27,15.81 31.95,15.5 31.95,15.45 Q1.1
N$6
  Top 0.254: C9.2 R1.1
N$7
  Top 0.254: 24.52,6.73 24.52,7.4 BATT.2
  Top 0.61: 24.52,6.73 24.52,4.7 24.77,4.45 27.19,4.45 27.63,4.89 29.66,4.89 D2.A
N$8
  Top 0.254: R1.2 11.73,30.58 10.99,29.85 10.99,23.37 10.42,22.8 9.34,22.8 9.15,22.61 9.15,20.45 9.47,20.13 IC2.3
N$9  (via drill 0.39)
  Top 0.406: IC2.6 12.71,22.03 v12.71,23.11 | v17.66,23.11 18.67,22.1 SP1.-
  Bottom 0.406: v12.71,23.11 v17.66,23.11
N$10
  Top 0.254: L.A 31.67,46.41 R5.2
N$11
  Top 0.254: LED1.1 38.89,13.55 LED2.3
N$12
  Top 0.254: LED3.1 41.67,23.38 41.67,22.48 42.85,21.29 42.85,19.05 LED1.3
N$13  (via drill 0.39)
  Top 0.254: LED2.1 32.15,10.42 32.9,11.18 v33.03,11.18 | v17.15,9.02 18,9.02 LED10.3
  Bottom 0.254: v17.15,9.02 20.46,9.02 23.5,12.07 32.14,12.07 v33.03,11.18
N$14
  Top 0.254: LED7.1 12.18,37.76 LED6.3
N$15  (via drill 0.39)
  Top 0.406: v11.44,22.23 10.33,22.23 10.33,22.22 IC2.1 | v17.15,16.64 17.29,16.5 SP1.+
  Bottom 0.406: v11.44,22.23 16.52,22.23 17.15,21.59 v17.15,16.64
N$16
  Top 0.254: LED7.3 8.65,32.56 8.65,28.13 9.14,27.64 LED8.1
N$17
  Top 0.254: LED8.3 7.39,19.8 8.39,18.8 10.1,18.8 LED9.1 10.16,18.73
N$18
  Top 0.254: LED9.3 12.59,12.64 15,12.64 15.71,11.92 LED10.1
N$19
  Top 0.254: LED4.1 40.82,31.7 43.43,29.1 LED3.3
N$20
  Top 0.254: LED4.3 40.28,36.05 38.61,37.72 36.35,37.72 35.44,38.63 LED5.1
N$21
  Top 0.254: D5.C 20.84,24.26 21.66,23.43 21.66,21.27 22.62,20.32 28.52,20.32 28.84,20 28.84,19.05 29.87,18.02 Q1.3 29.73,16.46
REMOTEIN  (via drill 0.39)
  Top 0.254: v34.49,23.31 34.49,22.04 34.3,21.84 U1.3 | U$5.21 29.64,36.11 29.75,36 v30.36,36
  Bottom 0.254: v30.36,36 30.81,36 31.12,36.32 32.2,36.32 32.65,35.88 32.65,34.8 32.71,34.74 32.71,27.69 33.35,27.05 33.35,24.13 34.17,23.31 v34.49,23.31
SWCLK/SPK_SD  (via drill 0.39)
  Top 0.254: U$5.45 21.39,33.61 v20.84,34.16 20.46,34.16 18.4,36.22 18.6,36.22 R10.1 | IC2.4 12.74,19.21 v12.71,19.18
  Bottom 0.254: 16.77,35.31 17.92,36.45 19.02,36.45 20.84,34.63 v20.84,34.16 | 16.77,35.31 TP5.P$1 | v12.71,19.18 11.06,19.18 10.04,20.19 10.04,23.88 10.68,24.51 14.49,24.51 17.41,27.43 17.41,30.1 19.06,31.75 19.06,33.02 16.77,35.31
SWDIO  (via drill 0.39)
  Top 0.254: U$5.46 20.56,33.11 v20.46,33.21
  Bottom 0.254: TP6.P$1 18.55,34.93 19.82,34.93 20.08,34.67 20.08,33.78 20.46,33.4 v20.46,33.21
VCC  (via drill 0.39)
  Top 0.305: IC2.5 13.22,21.08 13.73,20.57 16.14,20.57
  Top 0.406: U3.1 20.75,9.14 19.31,9.14 17.92,9.91 17.92,13.97 16.14,15.75 16.14,20.57 16.14,24.83 17.85,26.54 19.82,26.54 20.84,27.56 D5.A | C5.1 23.38,10.67 22.62,9.91 22.62,9.18 U3.3 | C4.1 30.43,11.11 31,10.54 31,9.97 v31.06,9.91
  Top 0.61: 20.78,7.68 20.78,6.12 F1.2 | 20.78,7.68 v21.98,7.68 22.68,7.68 U3.3 22.68,9.59 | 20.78,7.68 U3.1 | 35.44,3.5 36.97,5.02 VCC2.P$1
  Bottom 0.406: 31.25,3.94 31,4.19 31,9.84 v31.06,9.91
  Bottom 0.61: v21.98,7.68 24.46,7.68 28.2,3.94 31.25,3.94 35.88,3.94 36.97,5.02 VCC2.P$1